# Altium schematic sheet [03] - MCU,CONTROLS.SchDoc (part 2 of 2)
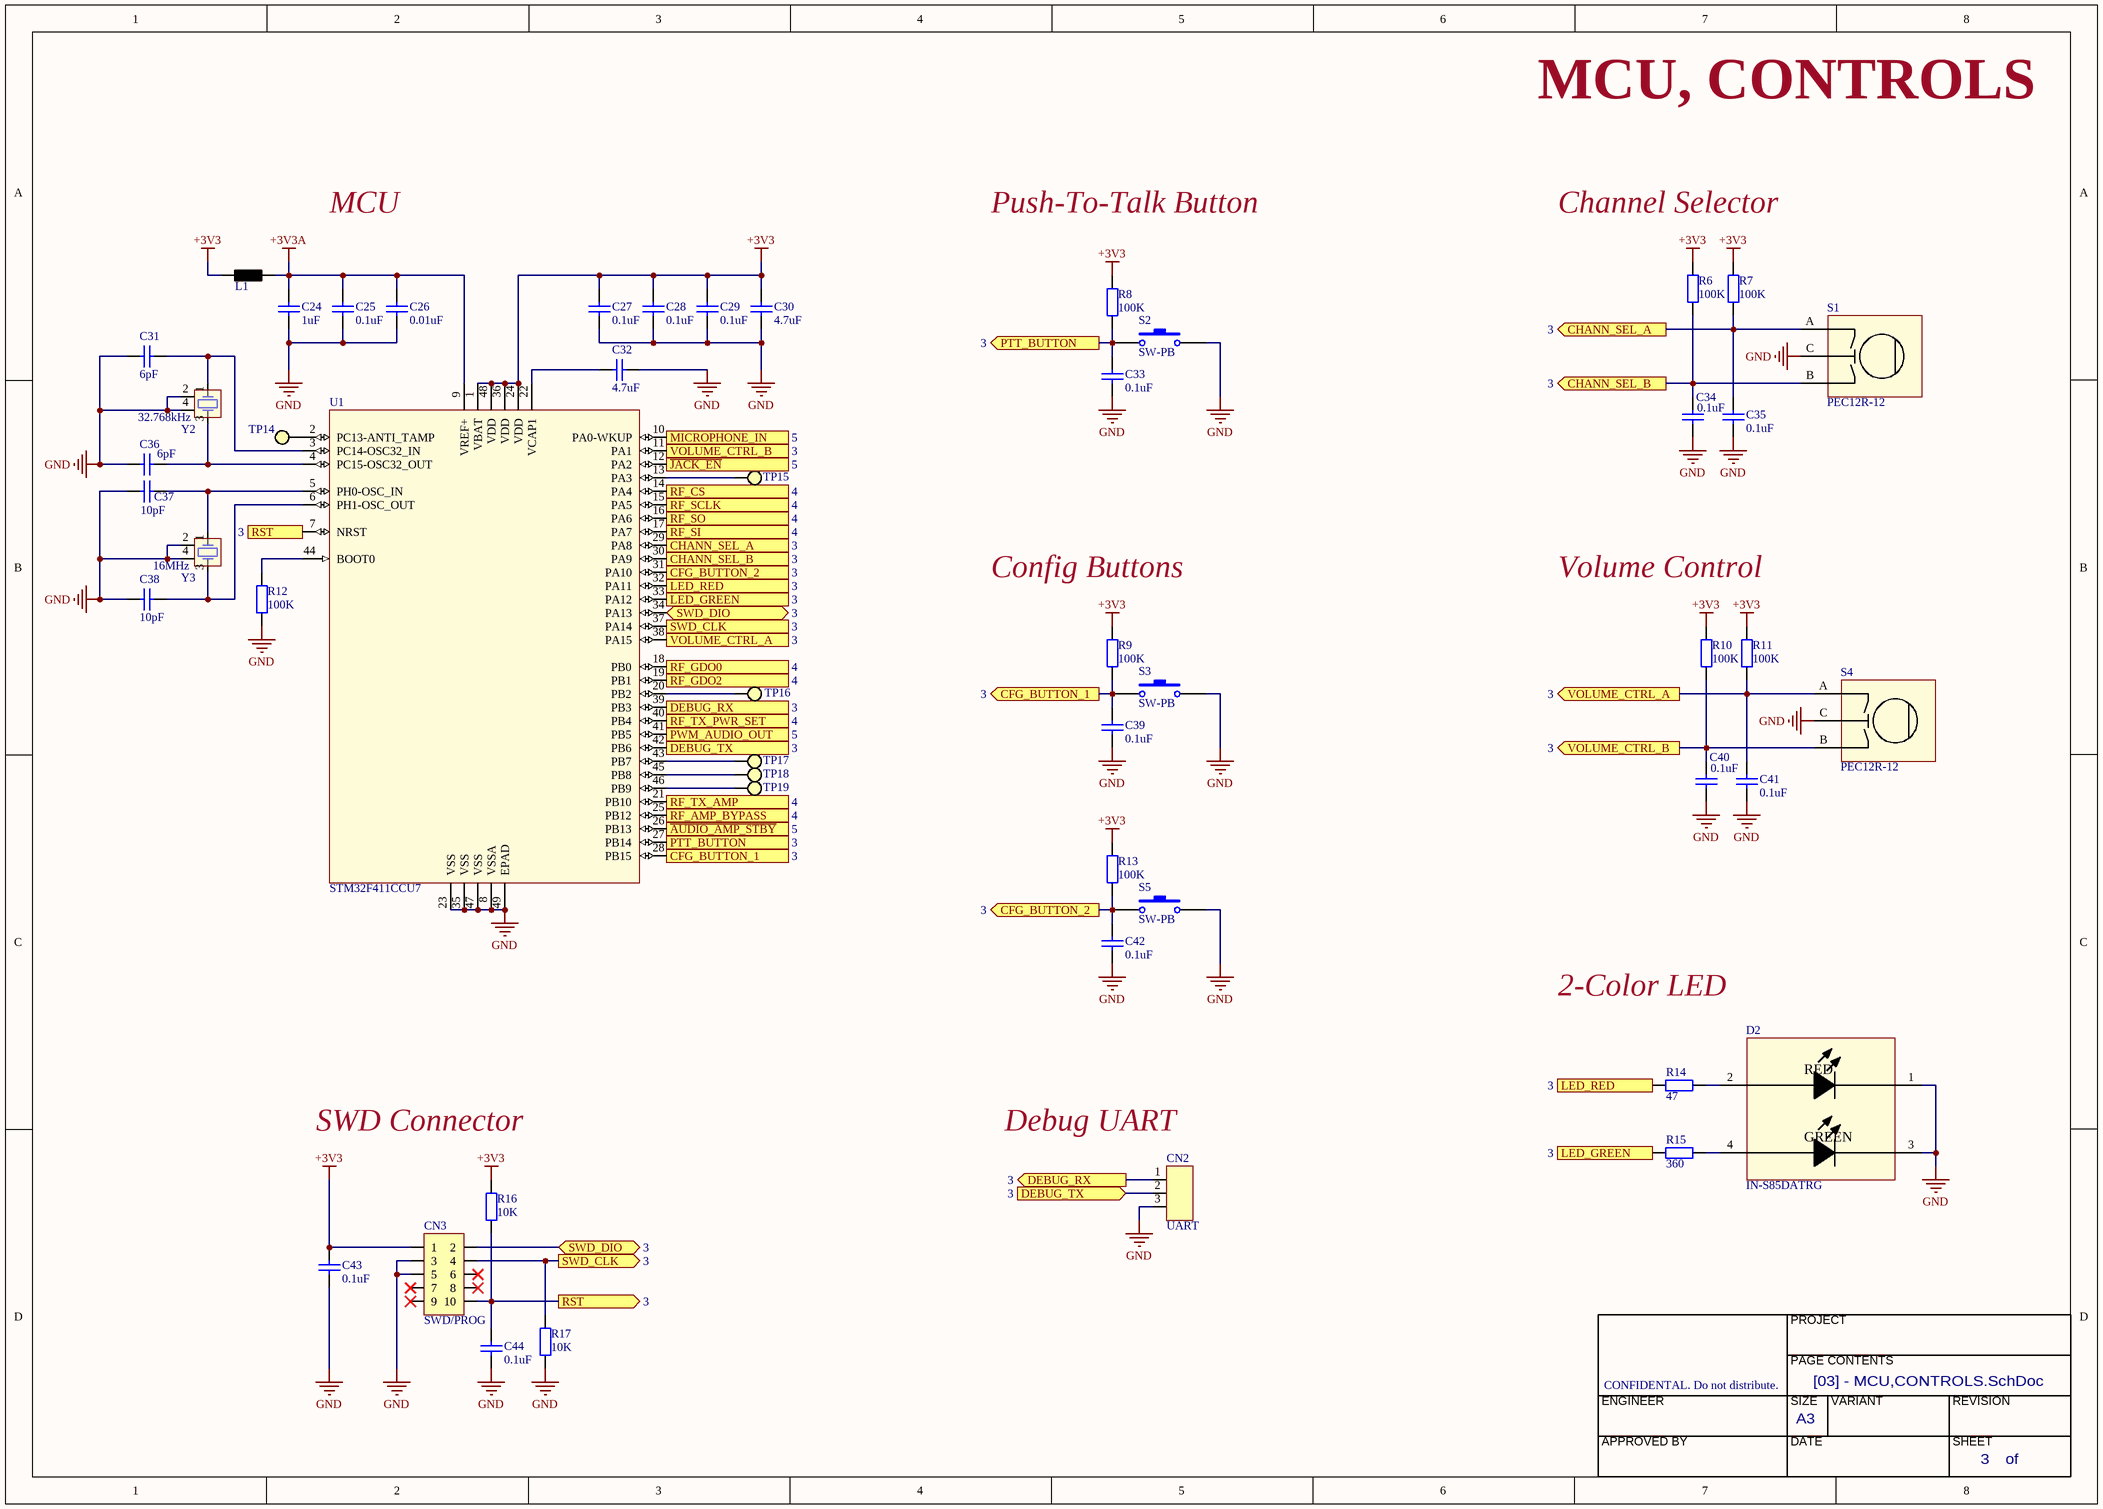
[diagram p1: [03] - MCU,CONTROLS.SchDoc]

## Library data of the parts
C24 = Cap: Capacitor; Manufacturer: Samsung; Manufacturer Part Number: CL10B105MO8NNWC; Description 1: SAMSUNG ELECTRO-MECHANICS - CL10B105MO8NNWC - SMD Multilayer Ceramic Capacitor, 1 µF, 16 V, 0603 [1608 Metric], ± 20%, X7R, CL Series; Voltage Rating: 16V; Tolerance: 20%; ComponentLink1URL: https://datasheet.ciiva.com/5999/1732731-5999390.pdf?src-supplier=Farnell; ComponentLink1Description: https://datasheet.ciiva.com/5999/1732731-5999390.pdf?src-supplier=Farnell; ComponentLink2URL: https://datasheet.ciiva.com/28645/1851736-28645613.pdf?src-supplier=Element14; ComponentLink2Description: https://datasheet.ciiva.com/28645/1851736-28645613.pdf?src-supplier=Element14; ComponentLink3URL: https://datasheet.ciiva.com/7823/kem-c1002-x7r-smd-7823982.pdf?src-supplier=Element14; ComponentLink3Description: https://datasheet.ciiva.com/7823/kem-c1002-x7r-smd-7823982.pdf?src-supplier=Element14; ComponentLink4URL: http://datasheet.octopart.com/C0603C104J4RACTU-KEMET-datasheet-137357764.pdf?src-supplier=Upverter; ComponentLink4Description: http://datasheet.octopart.com/C0603C104J4RACTU-KEMET-datasheet-137357764.pdf?src-supplier=Upverter; ComponentLink5URL: http://datasheet.octopart.com/C0603C104J4RAC-TU-Kemet-datasheet-5313890.pdf?src-supplier=Farnell; ComponentLink5Description: http://datasheet.octopart.com/C0603C104J4RAC-TU-Kemet-datasheet-5313890.pdf?src-supplier=Farnell; ComponentLink6URL: http://datasheet.octopart.com/C0603C104J4RACTU-Kemet-datasheet-10404442.pdf?src-supplier=Farnell; ComponentLink6Description: http://datasheet.octopart.com/C0603C104J4RACTU-Kemet-datasheet-10404442.pdf?src-supplier=Farnell; ComponentLink7URL: http://datasheet.octopart.com/C0603C104J4RACTU-Kemet-datasheet-10942409.pdf?src-supplier=Farnell; ComponentLink7Description: http://datasheet.octopart.com/C0603C104J4RACTU-Kemet-datasheet-10942409.pdf?src-supplier=Farnell; ComponentLink8URL: http://datasheet.octopart.com/C0603C104J4RACTU-Kemet-datasheet-11992184.pdf?src-supplier=Farnell; ComponentLink8Description: http://datasheet.octopart.com/C0603C104J4RACTU-Kemet-datasheet-11992184.pdf?src-supplier=Farnell; ComponentLink9URL: http://datasheet.octopart.com/C0603C104J4RACTU-Kemet-datasheet-12608295.pdf?src-supplier=Farnell; ComponentLink9Description: http://datasheet.octopart.com/C0603C104J4RACTU-Kemet-datasheet-12608295.pdf?src-supplier=Farnell; ComponentLink10URL: http://datasheet.octopart.com/C0603C104J4RACTU-KEMET-datasheet-101575649.pdf?src-supplier=Farnell; ComponentLink10Description: http://datasheet.octopart.com/C0603C104J4RACTU-KEMET-datasheet-101575649.pdf?src-supplier=Farnell; ComponentLink11URL: http://datasheet.octopart.com/C0603C104J4RACTU-Kemet-datasheet-464.pdf?src-supplier=Allied+Electronics; ComponentLink11Description: http://datasheet.octopart.com/C0603C104J4RACTU-Kemet-datasheet-464.pdf?src-supplier=Allied+Electronics; ComponentLink12URL: http://datasheet.octopart.com/C0603C104J4RAC-TU-Kemet-datasheet-8216256.pdf?src-supplier=Jameco; ComponentLink12Description: http://datasheet.octopart.com/C0603C104J4RAC-TU-Kemet-datasheet-8216256.pdf?src-supplier=Jameco; ComponentLink13URL: http://datasheet.octopart.com/C0603C104J4RAC-TU-Kemet-datasheet-5313836.pdf?src-supplier=Farnell; ComponentLink13Description: http://datasheet.octopart.com/C0603C104J4RAC-TU-Kemet-datasheet-5313836.pdf?src-supplier=Farnell; ComponentLink14URL: http://datasheet.octopart.com/C0603C104J4RAC-TU-Kemet-datasheet-5314449.pdf?src-supplier=Farnell; ComponentLink14Description: http://datasheet.octopart.com/C0603C104J4RAC-TU-Kemet-datasheet-5314449.pdf?src-supplier=Farnell; ComponentLink15URL: http://datasheet.octopart.com/C0603C104J4RAC-TU-Kemet-datasheet-5314627.pdf?src-supplier=Farnell; ComponentLink15Description: http://datasheet.octopart.com/C0603C104J4RAC-TU-Kemet-datasheet-5314627.pdf?src-supplier=Farnell; ComponentLink16URL: http://datasheet.octopart.com/C0603C104J4RAC-TU-Kemet-datasheet-5314837.pdf?src-supplier=Farnell; ComponentLink16Description: http://datasheet.octopart.com/C0603C104J4RAC-TU-Kemet-datasheet-5314837.pdf?src-supplier=Farnell; ComponentLink17URL: http://datasheet.octopart.com/C0603C104J4RAC-TU-Kemet-datasheet-5314969.pdf?src-supplier=Farnell; ComponentLink17Description: http://datasheet.octopart.com/C0603C104J4RAC-TU-Kemet-datasheet-5314969.pdf?src-supplier=Farnell; ComponentLink18URL: http://datasheet.octopart.com/C0603C104J4RAC-TU-Kemet-datasheet-5315946.pdf?src-supplier=Farnell; ComponentLink18Description: http://datasheet.octopart.com/C0603C104J4RAC-TU-Kemet-datasheet-5315946.pdf?src-supplier=Farnell; ComponentLink19URL: http://datasheet.octopart.com/C0603C104J4RAC-TU-Kemet-datasheet-5316294.pdf?src-supplier=Farnell; ComponentLink19Description: http://datasheet.octopart.com/C0603C104J4RAC-TU-Kemet-datasheet-5316294.pdf?src-supplier=Farnell; ComponentLink20URL: http://datasheet.octopart.com/C0603C104J4RAC-TU-Kemet-datasheet-5389132.pdf?src-supplier=Farnell; ComponentLink20Description: http://datasheet.octopart.com/C0603C104J4RAC-TU-Kemet-datasheet-5389132.pdf?src-supplier=Farnell; ComponentLink21URL: http://datasheet.octopart.com/C0603C104J4RAC-TU-Kemet-datasheet-5390537.pdf?src-supplier=Farnell; ComponentLink21Description: http://datasheet.octopart.com/C0603C104J4RAC-TU-Kemet-datasheet-5390537.pdf?src-supplier=Farnell; ComponentLink22URL: http://datasheet.octopart.com/C0603C104J4RAC-TU-Kemet-datasheet-7541751.pdf?src-supplier=Farnell; ComponentLink22Description: http://datasheet.octopart.com/C0603C104J4RAC-TU-Kemet-datasheet-7541751.pdf?src-supplier=Farnell; ComponentLink23URL: http://datasheet.octopart.com/C0603C104J4RAC-TU-Kemet-datasheet-7601896.pdf?src-supplier=Farnell; ComponentLink23Description: http://datasheet.octopart.com/C0603C104J4RAC-TU-Kemet-datasheet-7601896.pdf?src-supplier=Farnell; ComponentLink24URL: http://datasheet.octopart.com/C0603C104J4RAC-TU-Kemet-datasheet-7627733.pdf?src-supplier=Farnell; ComponentLink24Description: http://datasheet.octopart.com/C0603C104J4RAC-TU-Kemet-datasheet-7627733.pdf?src-supplier=Farnell; ComponentLink25URL: http://datasheet.octopart.com/C0603C104J4RAC-TU-Kemet-datasheet-7833651.pdf?src-supplier=Farnell; ComponentLink25Description: http://datasheet.octopart.com/C0603C104J4RAC-TU-Kemet-datasheet-7833651.pdf?src-supplier=Farnell; ComponentLink26URL: http://datasheet.octopart.com/C0603C104J4RAC-TU-Kemet-datasheet-8092359.pdf?src-supplier=Farnell; ComponentLink26Description: http://datasheet.octopart.com/C0603C104J4RAC-TU-Kemet-datasheet-8092359.pdf?src-supplier=Farnell; ComponentLink27URL: http://datasheet.octopart.com/C0603C104J4RAC-TU-Kemet-datasheet-8111010.pdf?src-supplier=Farnell; ComponentLink27Description: http://datasheet.octopart.com/C0603C104J4RAC-TU-Kemet-datasheet-8111010.pdf?src-supplier=Farnell; ComponentLink28URL: http://datasheet.octopart.com/C0603C104J4RACTU-Kemet-datasheet-22084244.pdf?src-supplier=Element14; ComponentLink28Description: http://datasheet.octopart.com/C0603C104J4RACTU-Kemet-datasheet-22084244.pdf?src-supplier=Element14; ComponentLink29URL: http://datasheet.octopart.com/C0603C104J4RACTU-Kemet-datasheet-21389237.pdf?src-supplier=Element14; ComponentLink29Description: http://datasheet.octopart.com/C0603C104J4RACTU-Kemet-datasheet-21389237.pdf?src-supplier=Element14; ComponentLink30URL: http://datasheet.octopart.com/C0603C104J4RACTU-Kemet-datasheet-24570007.pdf?src-supplier=Element14; ComponentLink30Description: http://datasheet.octopart.com/C0603C104J4RACTU-Kemet-datasheet-24570007.pdf?src-supplier=Element14; ComponentLink31URL: http://datasheet.octopart.com/C0603C104J4RACTU-Kemet-datasheet-27203261.pdf?src-supplier=Newark; ComponentLink31Description: http://datasheet.octopart.com/C0603C104J4RACTU-Kemet-datasheet-27203261.pdf?src-supplier=Newark; ComponentLink32URL: http://datasheet.octopart.com/C0603C104J4RACTU-Kemet-datasheet-67830779.pdf?src-supplier=TME; ComponentLink32Description: http://datasheet.octopart.com/C0603C104J4RACTU-Kemet-datasheet-67830779.pdf?src-supplier=TME; ComponentLink33URL: http://datasheet.octopart.com/C0603C104J4RACTU-KEMET-datasheet-84169754.pdf; ComponentLink33Description: http://datasheet.octopart.com/C0603C104J4RACTU-KEMET-datasheet-84169754.pdf; ComponentLink34URL: http://datasheet.octopart.com/C0603C104J4RACTU-KEMET-datasheet-110724412.pdf?src-supplier=Allied+Electronics; ComponentLink34Description: http://datasheet.octopart.com/C0603C104J4RACTU-KEMET-datasheet-110724412.pdf?src-supplier=Allied+Electronics; ComponentLink35URL: http://datasheet.octopart.com/C0603C104J4RACTU-KEMET-datasheet-68331906.pdf?src-supplier=TME; ComponentLink35Description: http://datasheet.octopart.com/C0603C104J4RACTU-KEMET-datasheet-68331906.pdf?src-supplier=TME; Supplier 1: Digi-Key; Supplier Part Number 1: 1276-6524-1-ND; Stock: 8432937; Pricing 1: 1=0.10000, 10=0.04200, 50=0.02300, 100=0.01880, 500=0.01344, 1000=0.01056 (USD); RoHS: Yes; Mount: Surface Mount; Case/Package: 0603; Case Code (Metric): 1608; Case Code (Imperial): 0603; Min Operating Temperature: -55°C; Max Operating Temperature: 125°C; Packaging: Tape and Reel; Capacitance: 1uF; Length: 0.063inch; Width: 0.031inch; Thickness: 0.035inch; ComponentLink36URL: https://media.digikey.com/pdf/Data%20Sheets/Samsung%20PDFs/CL10B105MO8NNWC.pdf?src-supplier=Digi-Key; ComponentLink36Description: https://media.digikey.com/pdf/Data%20Sheets/Samsung%20PDFs/CL10B105MO8NNWC.pdf?src-supplier=Digi-Key; ComponentLink37URL: http://www.farnell.com/datasheets/2710574.pdf?src-supplier=Farnell; ComponentLink37Description: http://www.farnell.com/datasheets/2710574.pdf?src-supplier=Farnell; ComponentLink38URL: http://www.farnell.com/datasheets/2710574.pdf?src-supplier=Element14; ComponentLink38Description: http://www.farnell.com/datasheets/2710574.pdf?src-supplier=Element14; ComponentLink39URL: http://www.farnell.com/datasheets/2710574.pdf?src-supplier=Newark; ComponentLink39Description: http://www.farnell.com/datasheets/2710574.pdf?src-supplier=Newark
C25 C27-C29 = Cap: Capacitor; Manufacturer: KEMET; Manufacturer Part Number: C0603C104M5RACTU; Description 1: Cap Ceramic 0.1uF 50V X7R 20% SMD 0603 125C T/R; Dielectric Material: Ceramic; Capacitance: 100nF; Tolerance: 20%; Voltage Rating: 50V; Dielectric: X7R; Dissipation Factor: 2.5%; ComponentLink1URL: https://datasheet.ciiva.com/5999/1732731-5999390.pdf?src-supplier=Farnell; ComponentLink1Description: https://datasheet.ciiva.com/5999/1732731-5999390.pdf?src-supplier=Farnell; ComponentLink2URL: https://datasheet.ciiva.com/28645/1851736-28645613.pdf?src-supplier=Element14; ComponentLink2Description: https://datasheet.ciiva.com/28645/1851736-28645613.pdf?src-supplier=Element14; ComponentLink3URL: https://datasheet.ciiva.com/7823/kem-c1002-x7r-smd-7823982.pdf?src-supplier=Element14; ComponentLink3Description: https://datasheet.ciiva.com/7823/kem-c1002-x7r-smd-7823982.pdf?src-supplier=Element14; ComponentLink4URL: http://datasheet.octopart.com/C0603C104J4RACTU-KEMET-datasheet-137357764.pdf?src-supplier=Upverter; ComponentLink4Description: http://datasheet.octopart.com/C0603C104J4RACTU-KEMET-datasheet-137357764.pdf?src-supplier=Upverter; ComponentLink5URL: http://datasheet.octopart.com/C0603C104J4RAC-TU-Kemet-datasheet-5313890.pdf?src-supplier=Farnell; ComponentLink5Description: http://datasheet.octopart.com/C0603C104J4RAC-TU-Kemet-datasheet-5313890.pdf?src-supplier=Farnell; ComponentLink6URL: http://datasheet.octopart.com/C0603C104J4RACTU-Kemet-datasheet-10404442.pdf?src-supplier=Farnell; ComponentLink6Description: http://datasheet.octopart.com/C0603C104J4RACTU-Kemet-datasheet-10404442.pdf?src-supplier=Farnell; ComponentLink7URL: http://datasheet.octopart.com/C0603C104J4RACTU-Kemet-datasheet-10942409.pdf?src-supplier=Farnell; ComponentLink7Description: http://datasheet.octopart.com/C0603C104J4RACTU-Kemet-datasheet-10942409.pdf?src-supplier=Farnell; ComponentLink8URL: http://datasheet.octopart.com/C0603C104J4RACTU-Kemet-datasheet-11992184.pdf?src-supplier=Farnell; ComponentLink8Description: http://datasheet.octopart.com/C0603C104J4RACTU-Kemet-datasheet-11992184.pdf?src-supplier=Farnell; ComponentLink9URL: http://datasheet.octopart.com/C0603C104J4RACTU-Kemet-datasheet-12608295.pdf?src-supplier=Farnell; ComponentLink9Description: http://datasheet.octopart.com/C0603C104J4RACTU-Kemet-datasheet-12608295.pdf?src-supplier=Farnell; ComponentLink10URL: http://datasheet.octopart.com/C0603C104J4RACTU-KEMET-datasheet-101575649.pdf?src-supplier=Farnell; ComponentLink10Description: http://datasheet.octopart.com/C0603C104J4RACTU-KEMET-datasheet-101575649.pdf?src-supplier=Farnell; ComponentLink11URL: http://datasheet.octopart.com/C0603C104J4RACTU-Kemet-datasheet-464.pdf?src-supplier=Allied+Electronics; ComponentLink11Description: http://datasheet.octopart.com/C0603C104J4RACTU-Kemet-datasheet-464.pdf?src-supplier=Allied+Electronics; ComponentLink12URL: http://datasheet.octopart.com/C0603C104J4RAC-TU-Kemet-datasheet-8216256.pdf?src-supplier=Jameco; ComponentLink12Description: http://datasheet.octopart.com/C0603C104J4RAC-TU-Kemet-datasheet-8216256.pdf?src-supplier=Jameco; ComponentLink13URL: http://datasheet.octopart.com/C0603C104J4RAC-TU-Kemet-datasheet-5313836.pdf?src-supplier=Farnell; ComponentLink13Description: http://datasheet.octopart.com/C0603C104J4RAC-TU-Kemet-datasheet-5313836.pdf?src-supplier=Farnell; ComponentLink14URL: http://datasheet.octopart.com/C0603C104J4RAC-TU-Kemet-datasheet-5314449.pdf?src-supplier=Farnell; ComponentLink14Description: http://datasheet.octopart.com/C0603C104J4RAC-TU-Kemet-datasheet-5314449.pdf?src-supplier=Farnell; ComponentLink15URL: http://datasheet.octopart.com/C0603C104J4RAC-TU-Kemet-datasheet-5314627.pdf?src-supplier=Farnell; ComponentLink15Description: http://datasheet.octopart.com/C0603C104J4RAC-TU-Kemet-datasheet-5314627.pdf?src-supplier=Farnell; ComponentLink16URL: http://datasheet.octopart.com/C0603C104J4RAC-TU-Kemet-datasheet-5314837.pdf?src-supplier=Farnell; ComponentLink16Description: http://datasheet.octopart.com/C0603C104J4RAC-TU-Kemet-datasheet-5314837.pdf?src-supplier=Farnell; ComponentLink17URL: http://datasheet.octopart.com/C0603C104J4RAC-TU-Kemet-datasheet-5314969.pdf?src-supplier=Farnell; ComponentLink17Description: http://datasheet.octopart.com/C0603C104J4RAC-TU-Kemet-datasheet-5314969.pdf?src-supplier=Farnell; ComponentLink18URL: http://datasheet.octopart.com/C0603C104J4RAC-TU-Kemet-datasheet-5315946.pdf?src-supplier=Farnell; ComponentLink18Description: http://datasheet.octopart.com/C0603C104J4RAC-TU-Kemet-datasheet-5315946.pdf?src-supplier=Farnell; ComponentLink19URL: http://datasheet.octopart.com/C0603C104J4RAC-TU-Kemet-datasheet-5316294.pdf?src-supplier=Farnell; ComponentLink19Description: http://datasheet.octopart.com/C0603C104J4RAC-TU-Kemet-datasheet-5316294.pdf?src-supplier=Farnell; ComponentLink20URL: http://datasheet.octopart.com/C0603C104J4RAC-TU-Kemet-datasheet-5389132.pdf?src-supplier=Farnell; ComponentLink20Description: http://datasheet.octopart.com/C0603C104J4RAC-TU-Kemet-datasheet-5389132.pdf?src-supplier=Farnell; ComponentLink21URL: http://datasheet.octopart.com/C0603C104J4RAC-TU-Kemet-datasheet-5390537.pdf?src-supplier=Farnell; ComponentLink21Description: http://datasheet.octopart.com/C0603C104J4RAC-TU-Kemet-datasheet-5390537.pdf?src-supplier=Farnell; ComponentLink22URL: http://datasheet.octopart.com/C0603C104J4RAC-TU-Kemet-datasheet-7541751.pdf?src-supplier=Farnell; ComponentLink22Description: http://datasheet.octopart.com/C0603C104J4RAC-TU-Kemet-datasheet-7541751.pdf?src-supplier=Farnell; ComponentLink23URL: http://datasheet.octopart.com/C0603C104J4RAC-TU-Kemet-datasheet-7601896.pdf?src-supplier=Farnell; ComponentLink23Description: http://datasheet.octopart.com/C0603C104J4RAC-TU-Kemet-datasheet-7601896.pdf?src-supplier=Farnell; ComponentLink24URL: http://datasheet.octopart.com/C0603C104J4RAC-TU-Kemet-datasheet-7627733.pdf?src-supplier=Farnell; ComponentLink24Description: http://datasheet.octopart.com/C0603C104J4RAC-TU-Kemet-datasheet-7627733.pdf?src-supplier=Farnell; ComponentLink25URL: http://datasheet.octopart.com/C0603C104J4RAC-TU-Kemet-datasheet-7833651.pdf?src-supplier=Farnell; ComponentLink25Description: http://datasheet.octopart.com/C0603C104J4RAC-TU-Kemet-datasheet-7833651.pdf?src-supplier=Farnell; ComponentLink26URL: http://datasheet.octopart.com/C0603C104J4RAC-TU-Kemet-datasheet-8092359.pdf?src-supplier=Farnell; ComponentLink26Description: http://datasheet.octopart.com/C0603C104J4RAC-TU-Kemet-datasheet-8092359.pdf?src-supplier=Farnell; ComponentLink27URL: http://datasheet.octopart.com/C0603C104J4RAC-TU-Kemet-datasheet-8111010.pdf?src-supplier=Farnell; ComponentLink27Description: http://datasheet.octopart.com/C0603C104J4RAC-TU-Kemet-datasheet-8111010.pdf?src-supplier=Farnell; ComponentLink28URL: http://datasheet.octopart.com/C0603C104J4RACTU-Kemet-datasheet-22084244.pdf?src-supplier=Element14; ComponentLink28Description: http://datasheet.octopart.com/C0603C104J4RACTU-Kemet-datasheet-22084244.pdf?src-supplier=Element14; ComponentLink29URL: http://datasheet.octopart.com/C0603C104J4RACTU-Kemet-datasheet-21389237.pdf?src-supplier=Element14; ComponentLink29Description: http://datasheet.octopart.com/C0603C104J4RACTU-Kemet-datasheet-21389237.pdf?src-supplier=Element14; ComponentLink30URL: http://datasheet.octopart.com/C0603C104J4RACTU-Kemet-datasheet-24570007.pdf?src-supplier=Element14; ComponentLink30Description: http://datasheet.octopart.com/C0603C104J4RACTU-Kemet-datasheet-24570007.pdf?src-supplier=Element14; ComponentLink31URL: http://datasheet.octopart.com/C0603C104J4RACTU-Kemet-datasheet-27203261.pdf?src-supplier=Newark; ComponentLink31Description: http://datasheet.octopart.com/C0603C104J4RACTU-Kemet-datasheet-27203261.pdf?src-supplier=Newark; ComponentLink32URL: http://datasheet.octopart.com/C0603C104J4RACTU-Kemet-datasheet-67830779.pdf?src-supplier=TME; ComponentLink32Description: http://datasheet.octopart.com/C0603C104J4RACTU-Kemet-datasheet-67830779.pdf?src-supplier=TME; ComponentLink33URL: http://datasheet.octopart.com/C0603C104J4RACTU-KEMET-datasheet-84169754.pdf; ComponentLink33Description: http://datasheet.octopart.com/C0603C104J4RACTU-KEMET-datasheet-84169754.pdf; ComponentLink34URL: http://datasheet.octopart.com/C0603C104J4RACTU-KEMET-datasheet-110724412.pdf?src-supplier=Allied+Electronics; ComponentLink34Description: http://datasheet.octopart.com/C0603C104J4RACTU-KEMET-datasheet-110724412.pdf?src-supplier=Allied+Electronics; ComponentLink35URL: http://datasheet.octopart.com/C0603C104J4RACTU-KEMET-datasheet-68331906.pdf?src-supplier=TME; ComponentLink35Description: http://datasheet.octopart.com/C0603C104J4RACTU-KEMET-datasheet-68331906.pdf?src-supplier=TME; Supplier 1: Digi-Key; Supplier Part Number 1: 399-7845-1-ND; Stock: 899636; Pricing 1: 1=0.10000, 10=0.03700, 50=0.02040, 100=0.01660, 500=0.01186, 1000=0.00932 (USD); RoHS: Yes; Mount: Surface Mount,PCB; Case/Package: 0603; Case Code (Metric): 1608; Case Code (Imperial): 0603; Contact Plating: Tin,Matte; Min Operating Temperature: -55°C; Max Operating Temperature: 125°C; Package Quantity: 1; Packaging: Tape and Reel; Voltage Rating (DC): 50V; Termination: SMD/SMT; Length: 1.6mm; Height: 0.8mm; Width: 0.031inch; Thickness: 0.034inch; Lead Pitch: 0.7mm; Depth: 0.8mm; Radiation Hardening: No; REACH SVHC: No SVHC; ComponentLink36URL: http://www.alliedelec.com/m/d/6f3b5eb83d09db50ed28bdc730567b33.pdf?src-supplier=Allied+Electronics; ComponentLink36Description: http://www.alliedelec.com/m/d/6f3b5eb83d09db50ed28bdc730567b33.pdf?src-supplier=Allied+Electronics; ComponentLink37URL: http://www.mouser.com/ds/2/212/KEM_C1002_X7R_SMD-1102033.pdf?src-supplier=Mouser; ComponentLink37Description: http://www.mouser.com/ds/2/212/KEM_C1002_X7R_SMD-1102033.pdf?src-supplier=Mouser; ComponentLink38URL: https://www.verical.com/server-webapp/html/getDatasheet?partID=626892&src-supplier=Verical; ComponentLink38Description: https://www.verical.com/server-webapp/html/getDatasheet?partID=626892&src-supplier=Verical; ComponentLink39URL: http://www.farnell.com/datasheets/2746056.pdf?src-supplier=Farnell; ComponentLink39Description: http://www.farnell.com/datasheets/2746056.pdf?src-supplier=Farnell; ComponentLink40URL: http://components.arrow.com/part/dataview/0323_00313986?src-supplier=Arrow+Europe; ComponentLink40Description: http://components.arrow.com/part/dataview/0323_00313986?src-supplier=Arrow+Europe; ComponentLink41URL: http://components.arrow.com/part/dataview/40911037S8853915N7429?src-supplier=Arrow; ComponentLink41Description: http://components.arrow.com/part/dataview/40911037S8853915N7429?src-supplier=Arrow; ComponentLink42URL: http://capacitoredge.kemet.com/capedge2/DataSheet?pn=C0603C104M5RAC7867&src-supplier=Avnet; ComponentLink42Description: http://capacitoredge.kemet.com/capedge2/DataSheet?pn=C0603C104M5RAC7867&src-supplier=Avnet; ComponentLink43URL: http://capacitoredge.kemet.com/capedge2/DataSheet?pn=C0603C104M5RAC7867&src-supplier=Avnet+Asia; ComponentLink43Description: http://capacitoredge.kemet.com/capedge2/DataSheet?pn=C0603C104M5RAC7867&src-supplier=Avnet+Asia; ComponentLink44URL: http://www.farnell.com/datasheets/2746056.pdf?src-supplier=Element14; ComponentLink44Description: http://www.farnell.com/datasheets/2746056.pdf?src-supplier=Element14; ComponentLink45URL: https://api.kemet.com/component-edge/download/datasheet/C0603C104M5RACTU.pdf?src-supplier=Digi-Key; ComponentLink45Description: https://api.kemet.com/component-edge/download/datasheet/C0603C104M5RACTU.pdf?src-supplier=Digi-Key; ComponentLink46URL: http://www.farnell.com/datasheets/2315113.pdf?src-supplier=Newark; ComponentLink46Description: http://www.farnell.com/datasheets/2315113.pdf?src-supplier=Newark; ComponentLink47URL: http://www.farnell.com/datasheets/1828800.pdf?src-supplier=Newark; ComponentLink47Description: http://www.farnell.com/datasheets/1828800.pdf?src-supplier=Newark; ComponentLink48URL: http://www.farnell.com/datasheets/2746056.pdf?src-supplier=Newark; ComponentLink48Description: http://www.farnell.com/datasheets/2746056.pdf?src-supplier=Newark; ComponentLink49URL: https://www.verical.com/server-webapp/html/getDatasheet?partID=110138&src-supplier=Verical; ComponentLink49Description: https://www.verical.com/server-webapp/html/getDatasheet?partID=110138&src-supplier=Verical
C26 = Cap: Capacitor; Manufacturer: KEMET; Manufacturer Part Number: C0603C103M5RACTU; Description 1: KEMET - C0603C103M5RACTU - SMD Multilayer Ceramic Capacitor, 10000 pF, 50 V, 0603 [1608 Metric], ± 20%, X7R, C Series KEMET; Dielectric Material: Ceramic; Capacitance: 10nF; Tolerance: 20%; Voltage Rating: 50V; Dielectric: X7R; Dissipation Factor: 2.5%; ComponentLink1URL: https://datasheet.ciiva.com/5999/1732731-5999390.pdf?src-supplier=Farnell; ComponentLink1Description: https://datasheet.ciiva.com/5999/1732731-5999390.pdf?src-supplier=Farnell; ComponentLink2URL: https://datasheet.ciiva.com/28645/1851736-28645613.pdf?src-supplier=Element14; ComponentLink2Description: https://datasheet.ciiva.com/28645/1851736-28645613.pdf?src-supplier=Element14; ComponentLink3URL: https://datasheet.ciiva.com/7823/kem-c1002-x7r-smd-7823982.pdf?src-supplier=Element14; ComponentLink3Description: https://datasheet.ciiva.com/7823/kem-c1002-x7r-smd-7823982.pdf?src-supplier=Element14; ComponentLink4URL: http://datasheet.octopart.com/C0603C104J4RACTU-KEMET-datasheet-137357764.pdf?src-supplier=Upverter; ComponentLink4Description: http://datasheet.octopart.com/C0603C104J4RACTU-KEMET-datasheet-137357764.pdf?src-supplier=Upverter; ComponentLink5URL: http://datasheet.octopart.com/C0603C104J4RAC-TU-Kemet-datasheet-5313890.pdf?src-supplier=Farnell; ComponentLink5Description: http://datasheet.octopart.com/C0603C104J4RAC-TU-Kemet-datasheet-5313890.pdf?src-supplier=Farnell; ComponentLink6URL: http://datasheet.octopart.com/C0603C104J4RACTU-Kemet-datasheet-10404442.pdf?src-supplier=Farnell; ComponentLink6Description: http://datasheet.octopart.com/C0603C104J4RACTU-Kemet-datasheet-10404442.pdf?src-supplier=Farnell; ComponentLink7URL: http://datasheet.octopart.com/C0603C104J4RACTU-Kemet-datasheet-10942409.pdf?src-supplier=Farnell; ComponentLink7Description: http://datasheet.octopart.com/C0603C104J4RACTU-Kemet-datasheet-10942409.pdf?src-supplier=Farnell; ComponentLink8URL: http://datasheet.octopart.com/C0603C104J4RACTU-Kemet-datasheet-11992184.pdf?src-supplier=Farnell; ComponentLink8Description: http://datasheet.octopart.com/C0603C104J4RACTU-Kemet-datasheet-11992184.pdf?src-supplier=Farnell; ComponentLink9URL: http://datasheet.octopart.com/C0603C104J4RACTU-Kemet-datasheet-12608295.pdf?src-supplier=Farnell; ComponentLink9Description: http://datasheet.octopart.com/C0603C104J4RACTU-Kemet-datasheet-12608295.pdf?src-supplier=Farnell; ComponentLink10URL: http://datasheet.octopart.com/C0603C104J4RACTU-KEMET-datasheet-101575649.pdf?src-supplier=Farnell; ComponentLink10Description: http://datasheet.octopart.com/C0603C104J4RACTU-KEMET-datasheet-101575649.pdf?src-supplier=Farnell; ComponentLink11URL: http://datasheet.octopart.com/C0603C104J4RACTU-Kemet-datasheet-464.pdf?src-supplier=Allied+Electronics; ComponentLink11Description: http://datasheet.octopart.com/C0603C104J4RACTU-Kemet-datasheet-464.pdf?src-supplier=Allied+Electronics; ComponentLink12URL: http://datasheet.octopart.com/C0603C104J4RAC-TU-Kemet-datasheet-8216256.pdf?src-supplier=Jameco; ComponentLink12Description: http://datasheet.octopart.com/C0603C104J4RAC-TU-Kemet-datasheet-8216256.pdf?src-supplier=Jameco; ComponentLink13URL: http://datasheet.octopart.com/C0603C104J4RAC-TU-Kemet-datasheet-5313836.pdf?src-supplier=Farnell; ComponentLink13Description: http://datasheet.octopart.com/C0603C104J4RAC-TU-Kemet-datasheet-5313836.pdf?src-supplier=Farnell; ComponentLink14URL: http://datasheet.octopart.com/C0603C104J4RAC-TU-Kemet-datasheet-5314449.pdf?src-supplier=Farnell; ComponentLink14Description: http://datasheet.octopart.com/C0603C104J4RAC-TU-Kemet-datasheet-5314449.pdf?src-supplier=Farnell; ComponentLink15URL: http://datasheet.octopart.com/C0603C104J4RAC-TU-Kemet-datasheet-5314627.pdf?src-supplier=Farnell; ComponentLink15Description: http://datasheet.octopart.com/C0603C104J4RAC-TU-Kemet-datasheet-5314627.pdf?src-supplier=Farnell; ComponentLink16URL: http://datasheet.octopart.com/C0603C104J4RAC-TU-Kemet-datasheet-5314837.pdf?src-supplier=Farnell; ComponentLink16Description: http://datasheet.octopart.com/C0603C104J4RAC-TU-Kemet-datasheet-5314837.pdf?src-supplier=Farnell; ComponentLink17URL: http://datasheet.octopart.com/C0603C104J4RAC-TU-Kemet-datasheet-5314969.pdf?src-supplier=Farnell; ComponentLink17Description: http://datasheet.octopart.com/C0603C104J4RAC-TU-Kemet-datasheet-5314969.pdf?src-supplier=Farnell; ComponentLink18URL: http://datasheet.octopart.com/C0603C104J4RAC-TU-Kemet-datasheet-5315946.pdf?src-supplier=Farnell; ComponentLink18Description: http://datasheet.octopart.com/C0603C104J4RAC-TU-Kemet-datasheet-5315946.pdf?src-supplier=Farnell; ComponentLink19URL: http://datasheet.octopart.com/C0603C104J4RAC-TU-Kemet-datasheet-5316294.pdf?src-supplier=Farnell; ComponentLink19Description: http://datasheet.octopart.com/C0603C104J4RAC-TU-Kemet-datasheet-5316294.pdf?src-supplier=Farnell; ComponentLink20URL: http://datasheet.octopart.com/C0603C104J4RAC-TU-Kemet-datasheet-5389132.pdf?src-supplier=Farnell; ComponentLink20Description: http://datasheet.octopart.com/C0603C104J4RAC-TU-Kemet-datasheet-5389132.pdf?src-supplier=Farnell; ComponentLink21URL: http://datasheet.octopart.com/C0603C104J4RAC-TU-Kemet-datasheet-5390537.pdf?src-supplier=Farnell; ComponentLink21Description: http://datasheet.octopart.com/C0603C104J4RAC-TU-Kemet-datasheet-5390537.pdf?src-supplier=Farnell; ComponentLink22URL: http://datasheet.octopart.com/C0603C104J4RAC-TU-Kemet-datasheet-7541751.pdf?src-supplier=Farnell; ComponentLink22Description: http://datasheet.octopart.com/C0603C104J4RAC-TU-Kemet-datasheet-7541751.pdf?src-supplier=Farnell; ComponentLink23URL: http://datasheet.octopart.com/C0603C104J4RAC-TU-Kemet-datasheet-7601896.pdf?src-supplier=Farnell; ComponentLink23Description: http://datasheet.octopart.com/C0603C104J4RAC-TU-Kemet-datasheet-7601896.pdf?src-supplier=Farnell; ComponentLink24URL: http://datasheet.octopart.com/C0603C104J4RAC-TU-Kemet-datasheet-7627733.pdf?src-supplier=Farnell; ComponentLink24Description: http://datasheet.octopart.com/C0603C104J4RAC-TU-Kemet-datasheet-7627733.pdf?src-supplier=Farnell; ComponentLink25URL: http://datasheet.octopart.com/C0603C104J4RAC-TU-Kemet-datasheet-7833651.pdf?src-supplier=Farnell; ComponentLink25Description: http://datasheet.octopart.com/C0603C104J4RAC-TU-Kemet-datasheet-7833651.pdf?src-supplier=Farnell; ComponentLink26URL: http://datasheet.octopart.com/C0603C104J4RAC-TU-Kemet-datasheet-8092359.pdf?src-supplier=Farnell; ComponentLink26Description: http://datasheet.octopart.com/C0603C104J4RAC-TU-Kemet-datasheet-8092359.pdf?src-supplier=Farnell; ComponentLink27URL: http://datasheet.octopart.com/C0603C104J4RAC-TU-Kemet-datasheet-8111010.pdf?src-supplier=Farnell; ComponentLink27Description: http://datasheet.octopart.com/C0603C104J4RAC-TU-Kemet-datasheet-8111010.pdf?src-supplier=Farnell; ComponentLink28URL: http://datasheet.octopart.com/C0603C104J4RACTU-Kemet-datasheet-22084244.pdf?src-supplier=Element14; ComponentLink28Description: http://datasheet.octopart.com/C0603C104J4RACTU-Kemet-datasheet-22084244.pdf?src-supplier=Element14; ComponentLink29URL: http://datasheet.octopart.com/C0603C104J4RACTU-Kemet-datasheet-21389237.pdf?src-supplier=Element14; ComponentLink29Description: http://datasheet.octopart.com/C0603C104J4RACTU-Kemet-datasheet-21389237.pdf?src-supplier=Element14; ComponentLink30URL: http://datasheet.octopart.com/C0603C104J4RACTU-Kemet-datasheet-24570007.pdf?src-supplier=Element14; ComponentLink30Description: http://datasheet.octopart.com/C0603C104J4RACTU-Kemet-datasheet-24570007.pdf?src-supplier=Element14; ComponentLink31URL: http://datasheet.octopart.com/C0603C104J4RACTU-Kemet-datasheet-27203261.pdf?src-supplier=Newark; ComponentLink31Description: http://datasheet.octopart.com/C0603C104J4RACTU-Kemet-datasheet-27203261.pdf?src-supplier=Newark; ComponentLink32URL: http://datasheet.octopart.com/C0603C104J4RACTU-Kemet-datasheet-67830779.pdf?src-supplier=TME; ComponentLink32Description: http://datasheet.octopart.com/C0603C104J4RACTU-Kemet-datasheet-67830779.pdf?src-supplier=TME; ComponentLink33URL: http://datasheet.octopart.com/C0603C104J4RACTU-KEMET-datasheet-84169754.pdf; ComponentLink33Description: http://datasheet.octopart.com/C0603C104J4RACTU-KEMET-datasheet-84169754.pdf; ComponentLink34URL: http://datasheet.octopart.com/C0603C104J4RACTU-KEMET-datasheet-110724412.pdf?src-supplier=Allied+Electronics; ComponentLink34Description: http://datasheet.octopart.com/C0603C104J4RACTU-KEMET-datasheet-110724412.pdf?src-supplier=Allied+Electronics; ComponentLink35URL: http://datasheet.octopart.com/C0603C104J4RACTU-KEMET-datasheet-68331906.pdf?src-supplier=TME; ComponentLink35Description: http://datasheet.octopart.com/C0603C104J4RACTU-KEMET-datasheet-68331906.pdf?src-supplier=TME; Supplier 1: Digi-Key; Supplier Part Number 1: 399-7842-1-ND; Stock: 551104; Pricing 1: 1=0.10000, 10=0.03300, 50=0.01820, 100=0.01480, 500=0.01058, 1000=0.00832 (USD); RoHS: Yes; Mount: Surface Mount,PCB; Case/Package: 0603; Number of Pins: 2; Case Code (Imperial): 0603; Case Code (Metric): 1608; Min Operating Temperature: -55°C; Max Operating Temperature: 125°C; Package Quantity: 1; Packaging: Tape and Reel; Voltage Rating (DC): 50V; Termination: SMD/SMT; Length: 1.6mm; Height: 0.8mm; Width: 0.8mm; Lead Pitch: 0.7mm; Thickness: 0.034inch; Depth: 0.8mm; Radiation Hardening: No; REACH SVHC: No SVHC; ComponentLink36URL: https://datasheet.ciiva.com/7823/kem-c1002-x7r-smd-7823979.pdf?src-supplier=Element14; ComponentLink36Description: https://datasheet.ciiva.com/7823/kem-c1002-x7r-smd-7823979.pdf?src-supplier=Element14; ComponentLink37URL: https://datasheet.ciiva.com/7823/kem-c1002-x7r-smd-7823980.pdf?src-supplier=Element14; ComponentLink37Description: https://datasheet.ciiva.com/7823/kem-c1002-x7r-smd-7823980.pdf?src-supplier=Element14
C30 C32 = Cap: Capacitor; Manufacturer: Samsung; Manufacturer Part Number: CL10A475KP8NNNC; Description 1: Cap Ceramic 4.7uF 10V X5R 10% Pad SMD 0603 85C T/R; Tolerance: 10%; Voltage Rating: 10V; Dielectric: X5R; ComponentLink1URL: https://datasheet.ciiva.com/25787/cl10a475ka8nqnc-25787017.pdf?src-supplier=Digi-Key; ComponentLink1Description: https://datasheet.ciiva.com/25787/cl10a475ka8nqnc-25787017.pdf?src-supplier=Digi-Key; ComponentLink2URL: http://datasheet.octopart.com/CL10A475KA8NQNC-Samsung-Electro-Mechanics-datasheet-136031786.pdf?src-supplier=Samsung+SCT; ComponentLink2Description: http://datasheet.octopart.com/CL10A475KA8NQNC-Samsung-Electro-Mechanics-datasheet-136031786.pdf?src-supplier=Samsung+SCT; ComponentLink3URL: http://datasheet.octopart.com/CL10A475KA8NQNC-Samsung-Electro-Mechanics-datasheet-68304637.pdf?src-supplier=Future+Electronics; ComponentLink3Description: http://datasheet.octopart.com/CL10A475KA8NQNC-Samsung-Electro-Mechanics-datasheet-68304637.pdf?src-supplier=Future+Electronics; ComponentLink4URL: http://datasheet.octopart.com/CL10A475KA8NQNC-Samsung-Electro-Mechanics-datasheet-100454038.pdf?src-supplier=Future+Electronics; ComponentLink4Description: http://datasheet.octopart.com/CL10A475KA8NQNC-Samsung-Electro-Mechanics-datasheet-100454038.pdf?src-supplier=Future+Electronics; ComponentLink5URL: http://datasheet.octopart.com/CL10A475KA8NQNC-Samsung-Electro-Mechanics-datasheet-133510619.pdf?src-supplier=Future+Electronics; ComponentLink5Description: http://datasheet.octopart.com/CL10A475KA8NQNC-Samsung-Electro-Mechanics-datasheet-133510619.pdf?src-supplier=Future+Electronics; ComponentLink6URL: http://datasheet.octopart.com/CL10A475KA8NQNC-Samsung-datasheet-42901174.pdf?src-supplier=Future+Electronics; ComponentLink6Description: http://datasheet.octopart.com/CL10A475KA8NQNC-Samsung-datasheet-42901174.pdf?src-supplier=Future+Electronics; ComponentLink7URL: http://datasheet.octopart.com/CL10A475KA8NQNC-Samsung-datasheet-66660282.pdf?src-supplier=Future+Electronics; ComponentLink7Description: http://datasheet.octopart.com/CL10A475KA8NQNC-Samsung-datasheet-66660282.pdf?src-supplier=Future+Electronics; Supplier 1: Digi-Key; Supplier Part Number 1: 1276-1044-1-ND; Stock: 2576890; Pricing 1: 1=0.10000, 10=0.05300, 50=0.02880, 100=0.02360, 500=0.01682, 1000=0.01322 (USD); RoHS: Yes; Mount: Surface Mount; Case/Package: 0603; Case Code (Imperial): 0603; Contact Plating: Tin; Case Code (Metric): 1608; Min Operating Temperature: -55°C; Max Operating Temperature: 85°C; Package Quantity: 1; Packaging: Tape and Reel; Capacitance: 4.7uF; Length: 1.6mm; Height: 0.8mm; Thickness: 0.035inch; Depth: 0.8mm; Width: 0.031inch; Radiation Hardening: No; ComponentLink8URL: https://datasheet.ciiva.com/25797/cl10a475kp8nnnc-25797520.pdf?src-supplier=Digi-Key; ComponentLink8Description: https://datasheet.ciiva.com/25797/cl10a475kp8nnnc-25797520.pdf?src-supplier=Digi-Key; ComponentLink9URL: https://datasheet.ciiva.com/26838/getdatasheetpartid-358676-26838384.pdf?src-supplier=Verical; ComponentLink9Description: https://datasheet.ciiva.com/26838/getdatasheetpartid-358676-26838384.pdf?src-supplier=Verical; ComponentLink10URL: https://datasheet.ciiva.com/16318/cl05b104kq5nnnc-16318245.pdf?src-supplier=Future+Electronics; ComponentLink10Description: https://datasheet.ciiva.com/16318/cl05b104kq5nnnc-16318245.pdf?src-supplier=Future+Electronics
C31 C33-C43 = cap: Multilayer Ceramic Capacitors MLCC - SMD/SMT 50V .1uF X7R 0603 10% Tol; Manufacturer: TDK; Manufacturer Part Number: CGA3E2X5R1H104K080AA; Description 2: CAP CER 0.1UF 100V X7S 0603; Description 1: CAP CER 0.1UF 50V X5R 0603; Capacitance: 100nF; Dielectric: X5R; ComponentLink1URL: https://datasheet.ciiva.com/24216/cga3e2x7r1h102k080aa-265935-24216863.pdf?src-supplier=Mouser; ComponentLink1Description: https://datasheet.ciiva.com/24216/cga3e2x7r1h102k080aa-265935-24216863.pdf?src-supplier=Mouser; ComponentLink2URL: https://datasheet.ciiva.com/46424/1839935-46424223.pdf?src-supplier=Element14; ComponentLink2Description: https://datasheet.ciiva.com/46424/1839935-46424223.pdf?src-supplier=Element14; Features: Soft Termination; Ratings: AEC-Q200; ComponentLink3URL: http://www.mouser.com/ds/2/40/AutoMLCC-777028.pdf?src-supplier=Mouser; ComponentLink3Description: http://www.mouser.com/ds/2/40/AutoMLCC-777028.pdf?src-supplier=Mouser; ComponentLink4URL: http://components.arrow.com/part/dataview/0323_03442275?src-supplier=Arrow+Europe; ComponentLink4Description: http://components.arrow.com/part/dataview/0323_03442275?src-supplier=Arrow+Europe; ComponentLink5URL: http://catalogs.avx.com/SurfaceMount.pdf?src-supplier=Digi-Key; ComponentLink5Description: http://catalogs.avx.com/SurfaceMount.pdf?src-supplier=Digi-Key; ComponentLink6URL: http://www.avx.com/docs/Catalogs/flexiterm.pdf?src-supplier=Future+Electronics; ComponentLink6Description: http://www.avx.com/docs/Catalogs/flexiterm.pdf?src-supplier=Future+Electronics; ComponentLink7URL: https://www.avx.com/docs/Catalogs/flexiterm.pdf?src-supplier=Avnet; ComponentLink7Description: https://www.avx.com/docs/Catalogs/flexiterm.pdf?src-supplier=Avnet; Supplier 2: Digi-Key; Supplier Part Number 2: 445-5202-1-ND; Stock 2: 75283; Pricing 2: 1=0,21000, 10=0,14900, 50=0,08460, 100=0,07000, 500=0,04910, 1000=0,04065 (USD); ComponentLink8URL: https://datasheet.ciiva.com/24219/c1608x7s2a104m080ab-264673-24219216.pdf?src-supplier=Mouser; ComponentLink8Description: https://datasheet.ciiva.com/24219/c1608x7s2a104m080ab-264673-24219216.pdf?src-supplier=Mouser; ComponentLink9URL: https://datasheet.ciiva.com/26919/getdatasheetpartid-756132-26919198.pdf?src-supplier=Verical; ComponentLink9Description: https://datasheet.ciiva.com/26919/getdatasheetpartid-756132-26919198.pdf?src-supplier=Verical; Supplier 1: Digi-Key; Supplier Part Number 1: 445-12498-1-ND; RoHS: Yes; Category: Ceramic Capacitors; Stock 1: 20972; Pricing 1: 1=0,10000, 10=0,07300, 50=0,03960, 100=0,03230, 500=0,02310, 1000=0,01815 (USD); Mount: Surface Mount; Case/Package: 0603; Case Code (Metric): 1608; Case Code (Imperial): 0603; Weight: 7.1E-05oz; Min Operating Temperature: -55°C; Max Operating Temperature: 85°C; Package Quantity: 4000; Packaging: Tape and Reel; Tolerance: 10%; Voltage Rating: 50V; Termination: SMD/SMT; Voltage Rating (DC): 50V; Series: CGA; Length: 0.063inch; Width: 0.8mm; Height: 0.8mm; Thickness: 0.035inch; RoHS Compliant: Yes; ComponentLink10URL: http://www.mouser.com/ds/2/400/lcc_automotive_general_en-843974.pdf?src-supplier=Mouser; ComponentLink10Description: http://www.mouser.com/ds/2/400/lcc_automotive_general_en-843974.pdf?src-supplier=Mouser; ComponentLink11URL: https://product.tdk.com/info/en/documents/chara_sheet/CGA3E2X5R1H104K080AA.pdf?src-supplier=Digi-Key; ComponentLink11Description: https://product.tdk.com/info/en/documents/chara_sheet/CGA3E2X5R1H104K080AA.pdf?src-supplier=Digi-Key; ComponentLink12URL: http://product.tdk.com/en/catalog/datasheets/mlcc_automotive_general_en.pdf?src-supplier=Avnet; ComponentLink12Description: http://product.tdk.com/en/catalog/datasheets/mlcc_automotive_general_en.pdf?src-supplier=Avnet; ComponentLink13URL: https://product.tdk.com/info/en/catalog/datasheets/mlcc_automotive_general_en.pdf?src-supplier=Digi-Key; ComponentLink13Description: https://product.tdk.com/info/en/catalog/datasheets/mlcc_automotive_general_en.pdf?src-supplier=Digi-Key
C44 = cap: Manufacturer: TDK; Manufacturer Part Number: CGA3E2X5R1H104K080AA; Description 1: CAP CER 0.1UF 50V X5R 0603; Capacitance: 100nF; Tolerance: 10%; Voltage Rating: 50V; Dielectric: X5R; ComponentLink1URL: https://datasheet.ciiva.com/24216/cga3e2x7r1h102k080aa-265935-24216863.pdf?src-supplier=Mouser; ComponentLink1Description: https://datasheet.ciiva.com/24216/cga3e2x7r1h102k080aa-265935-24216863.pdf?src-supplier=Mouser; ComponentLink2URL: https://datasheet.ciiva.com/46424/1839935-46424223.pdf?src-supplier=Element14; ComponentLink2Description: https://datasheet.ciiva.com/46424/1839935-46424223.pdf?src-supplier=Element14; ComponentLink3URL: https://datasheet.ciiva.com/24219/c1608x7s2a104m080ab-264673-24219216.pdf?src-supplier=Mouser; ComponentLink3Description: https://datasheet.ciiva.com/24219/c1608x7s2a104m080ab-264673-24219216.pdf?src-supplier=Mouser; ComponentLink4URL: https://datasheet.ciiva.com/26919/getdatasheetpartid-756132-26919198.pdf?src-supplier=Verical; ComponentLink4Description: https://datasheet.ciiva.com/26919/getdatasheetpartid-756132-26919198.pdf?src-supplier=Verical; Supplier 1: Digi-Key; Supplier Part Number 1: 445-12498-1-ND; RoHS: Yes; Category: Ceramic Capacitors; Stock 1: 20972; Pricing 1: 1=0,10000, 10=0,07300, 50=0,03960, 100=0,03230, 500=0,02310, 1000=0,01815 (USD); Mount: Surface Mount; Case/Package: 0603; Case Code (Metric): 1608; Case Code (Imperial): 0603; Weight: 7.1E-05oz; Min Operating Temperature: -55°C; Max Operating Temperature: 85°C; Package Quantity: 4000; Packaging: Tape and Reel; Termination: SMD/SMT; Voltage Rating (DC): 50V; Series: CGA; Length: 0.063inch; Width: 0.8mm; Height: 0.8mm; Thickness: 0.035inch; Ratings: AEC-Q200; RoHS Compliant: Yes; ComponentLink5URL: http://www.mouser.com/ds/2/400/lcc_automotive_general_en-843974.pdf?src-supplier=Mouser; ComponentLink5Description: http://www.mouser.com/ds/2/400/lcc_automotive_general_en-843974.pdf?src-supplier=Mouser; ComponentLink6URL: https://product.tdk.com/info/en/documents/chara_sheet/CGA3E2X5R1H104K080AA.pdf?src-supplier=Digi-Key; ComponentLink6Description: https://product.tdk.com/info/en/documents/chara_sheet/CGA3E2X5R1H104K080AA.pdf?src-supplier=Digi-Key; ComponentLink7URL: http://product.tdk.com/en/catalog/datasheets/mlcc_automotive_general_en.pdf?src-supplier=Avnet; ComponentLink7Description: http://product.tdk.com/en/catalog/datasheets/mlcc_automotive_general_en.pdf?src-supplier=Avnet; ComponentLink8URL: https://product.tdk.com/info/en/catalog/datasheets/mlcc_automotive_general_en.pdf?src-supplier=Digi-Key; ComponentLink8Description: https://product.tdk.com/info/en/catalog/datasheets/mlcc_automotive_general_en.pdf?src-supplier=Digi-Key
CN2 = CONN-1x3pin: Connector 1x3; Manufacturer: *; Manufacturer Part Number: *; Supplier 1: Digi-Key; Supplier Part Number 1: *
CN3 = SWD/PROG: Manufacturer: AMPHENOL ICC (FCI); Manufacturer Part Number: 20021511-00010T4LF; Description 1: Conn Shrouded Header (4 Sides) HDR 10 POS 1.27mm Solder ST Thru-Hole Tube; Supplier 1: Digi-Key; Supplier Part Number 1: 609-5420-ND; RoHS: No; Stock 1: 299; Pricing 1: 1=1,40000, 22=1,22818, 88=1,05966, 440=0,86700, 946=0,77067, 4906=0,67434, 9812=0,64062 (USD); ComponentLink1URL: https://cdn.amphenol-icc.com/media/wysiwyg/files/drawing/20021511.pdf?src-supplier=Digi-Key; ComponentLink1Description: https://cdn.amphenol-icc.com/media/wysiwyg/files/drawing/20021511.pdf?src-supplier=Digi-Key
D2 = IN-S85DATRG: SMD LED 0805 Red, Green; Manufacturer: Inolux; Description 1: Led Green/red Clear 0805 SMD; Color: Green,Red; Lens Color: Clear; Lens Style: Flat; Luminous Intensity: 140mcd; Forward Voltage: 2.2V; Test Current: 20mA; Viewing Angle: 120°; Dominant Wavelength: 522nm; Lens Size: 1.25mm; Supplier 1: Digi-Key; Supplier Part Number 1: 1830-1085-1-ND; Manufacturer Part Number: IN-S85DATRG; RoHS: No; Stock 1: 72542; Pricing 1: 1=0,43000, 10=0,28100, 100=0,18760, 500=0,12974, 1000=0,10812 (USD); Mount: Surface Mount; Case/Package: 0805; Packaging: Tape and Reel; Lens Transparency: Clear; Length: 2mm; Width: 1.25mm; Height: 1.1mm; ComponentLink1URL: http://www.inolux-corp.com/datasheet/SMDLED/Bi-Color%20Top%20View/IN-S85DATRG_V1.0.pdf?src-supplier=Digi-Key; ComponentLink1Description: http://www.inolux-corp.com/datasheet/SMDLED/Bi-Color%20Top%20View/IN-S85DATRG_V1.0.pdf?src-supplier=Digi-Key
L1 = Ferrite_Bead: Ferrite Bead 600 Ohm @ 100MHz 1.3A 0603; Manufacturer: Murata Electronics North America; Filter Type: Power Line; Number of Lines: 1; DC Resistance (DCR) (Max): 150 mOhm; Description 1: FERRITE BEAD 600 OHM 0603 1LN; Supplier 1: Digi-Key; Supplier Part Number 1: 490-5258-1-ND; Manufacturer Part Number: BLM18KG601SN1D; RoHS: RoHS Compliant; Category: Filters; Stock 1: 590495; Pricing 1: 1=0.1, 10=0.075, 25=0.0684, 50=0.0614, 100=0.045, 250=0.03272, 500=0.03, 1000=0.02592 (USD); Packaging: Cut Tape (CT); Part Status: Active; Impedance @ Frequency: 600 Ohm @ 100MHz; Current Rating (Max): 1.3A; Ratings: -; Operating Temperature: -55°C ~ 125°C; Package / Case: 0603 (1608 Metric); Mounting Type: Surface Mount; Height (Max): 0.037" (0.95mm); Size / Dimension: 0.063" L x 0.032" W (1.60mm x 0.80mm); ComponentLink1URL: http://media.digikey.com/pdf/Data%20Sheets/Murata%20PDFs/BLM18yyyyyyN1x.pdf; ComponentLink1Description: http://media.digikey.com/pdf/Data%20Sheets/Murata%20PDFs/BLM18yyyyyyN1x.pdf
R6-R17 = res: Manufacturer: Panasonic; Manufacturer Part Number: ERJ-3EKF1002V; Description 1: PANASONIC - ERJ-3EKF1002V. - THICK FILM CHIP RES, 0603, 1%, PRECISION; Resistance: 10kR; Power Rating: 100mW; Tolerance: 1%; Voltage Rating: 75V; Temperature Coefficient: 100ppm/°C; ComponentLink1URL: http://www.vishay.com/docs/28773/crcwce3.pdf?src-supplier=Digi-Key; ComponentLink1Description: http://www.vishay.com/docs/28773/crcwce3.pdf?src-supplier=Digi-Key; ComponentLink2URL: http://components.arrow.com/part/dataview/3984768S7115702N1386?src-supplier=Arrow+Electronics; ComponentLink2Description: http://components.arrow.com/part/dataview/3984768S7115702N1386?src-supplier=Arrow+Electronics; ComponentLink3URL: http://components.arrow.com/part/dataview/0323_02069964?src-supplier=Arrow+Europe; ComponentLink3Description: http://components.arrow.com/part/dataview/0323_02069964?src-supplier=Arrow+Europe; ComponentLink4URL: http://www.jameco.com/Jameco/Products/ProdDS/1987468.pdf?src-supplier=Jameco; ComponentLink4Description: http://www.jameco.com/Jameco/Products/ProdDS/1987468.pdf?src-supplier=Jameco; ComponentLink5URL: http://industrial.panasonic.com/cdbs/www-data/pdf/RDA0000/AOA0000C304.pdf?src-supplier=Farnell; ComponentLink5Description: http://industrial.panasonic.com/cdbs/www-data/pdf/RDA0000/AOA0000C304.pdf?src-supplier=Farnell; ComponentLink6URL: https://industrial.panasonic.com/cdbs/www-data/pdf/RDA0000/DMA0000COL11.pdf?src-supplier=Allied+Electronics; ComponentLink6Description: https://industrial.panasonic.com/cdbs/www-data/pdf/RDA0000/DMA0000COL11.pdf?src-supplier=Allied+Electronics; ComponentLink7URL: https://industrial.panasonic.com/cdbs/www-data/pdf/RDA0000/DMA0000COL11.pdf?src-supplier=RSComponents; ComponentLink7Description: https://industrial.panasonic.com/cdbs/www-data/pdf/RDA0000/DMA0000COL11.pdf?src-supplier=RSComponents; ComponentLink8URL: http://www.farnell.com/datasheets/1911175.pdf?src-supplier=Element14; ComponentLink8Description: http://www.farnell.com/datasheets/1911175.pdf?src-supplier=Element14; Supplier 1: Digi-Key; Supplier Part Number 1: P10.0KHCT-ND; RoHS: Yes; Category: Chip SMD Resistors; Stock 1: 7629588; Pricing 1: 1=0,10000, 10=0,03700, 100=0,01490, 1000=0,00670, 2500=0,00582 (USD); Mount: Surface Mount; Case/Package: 0603; Number of Pins: 2; Case Code (Metric): 1608; Case Code (Imperial): 0603; Contact Plating: Tin; Size Code: 0603; Min Operating Temperature: -55°C; Max Operating Temperature: 155°C; Packaging: Tape and Reel; Package Quantity: 1; Resistor Type: Thick Film; Number of Terminations: 2; Termination: SMD/SMT; Max Power Dissipation: 100mW; Voltage Rating (DC): 75V; Features: Automotive AEC-Q200; Series: ERJ; Resistance Tolerance: 1%; Construction: Rectangular; Technology: THICK FILM; Length: 1.6mm; Width: 0.031inch; Height: 0.45mm; Depth: 0.8mm; Radiation Hardening: No; REACH SVHC: No SVHC; Military Standard: Not; Lead Free: Lead Free; RoHS Compliant: Yes
S2 S3 S5 = SW-PB: Switch; Manufacturer: *; Manufacturer Part Number: *; Supplier 1: Digi-Key; Supplier Part Number 1: *
Y2 Y3 = XTAL_4pin: Crystal Oscillator; DigiKey: *